# Altium schematic sheet DAC_Filter.SchDoc
size A4; DocumentNumber: 5; SheetNumber: 5; SheetTotal: 9
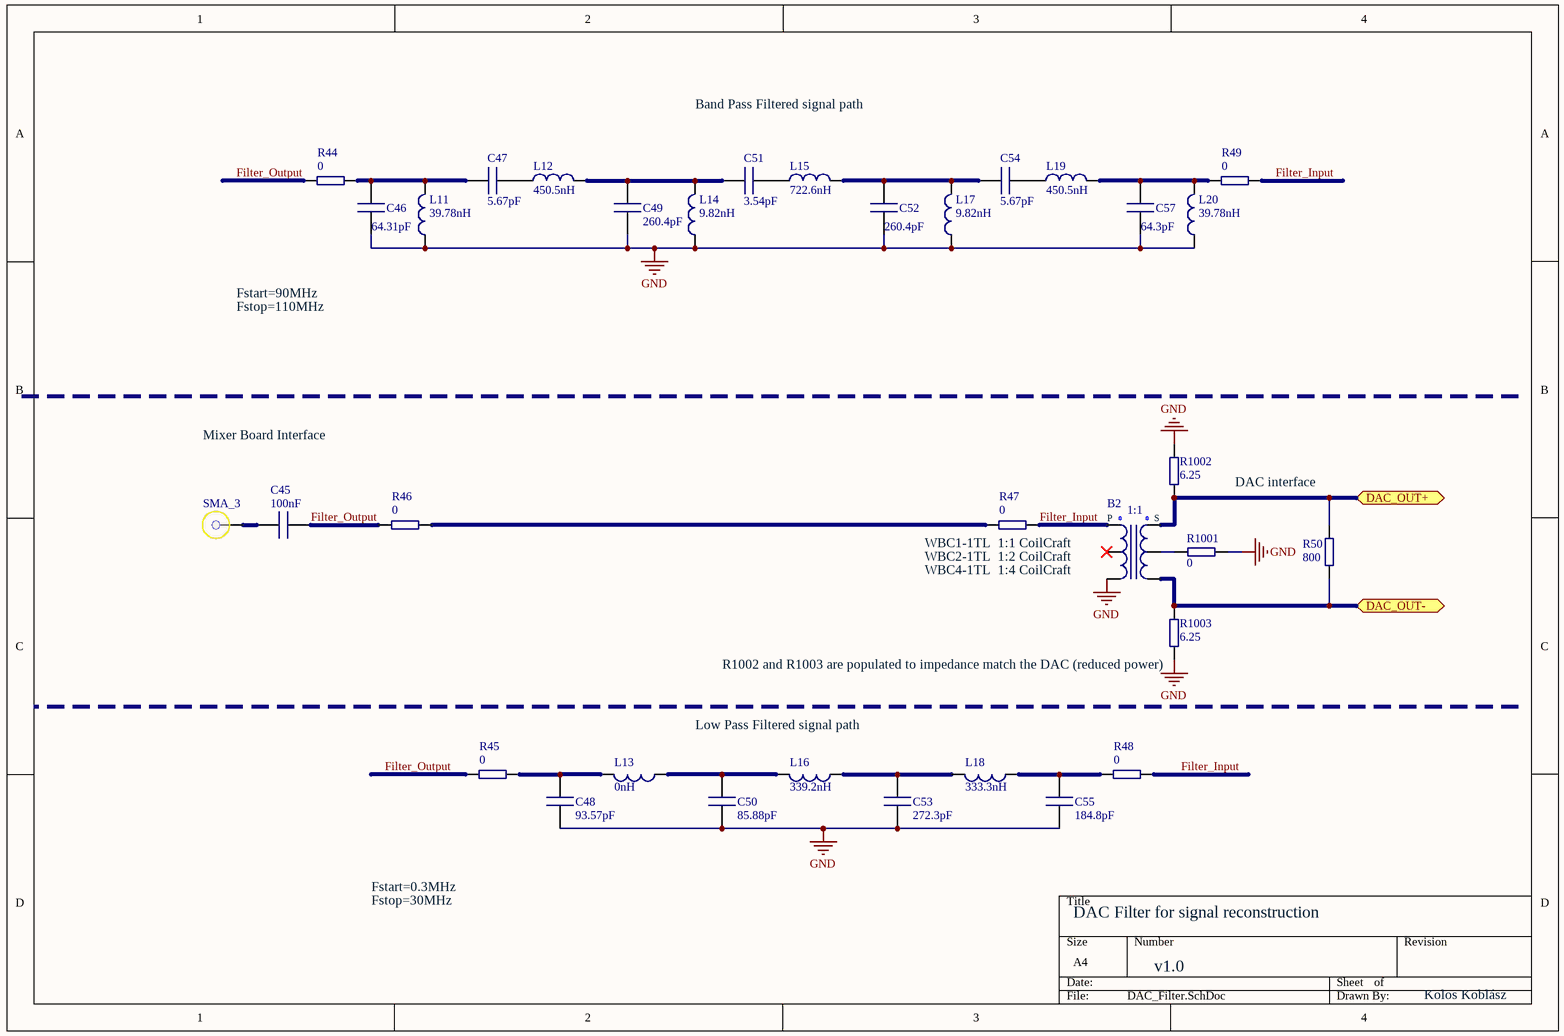
[diagram p0: DAC_Filter.SchDoc]

## Parts
B2  ImpedanceTransformation P : S: 1:1  [Balun_Coil_Craft_WBC]  (hidden comment: Balun)
C45  value 100nF  [0805 SMD Passive]  (hidden comment: Cap1)
C46  value 64.31pF  [0805 SMD Passive]  (hidden comment: Cap1)
C47  value 5.67pF  [0805 SMD Passive]  (hidden comment: Cap1)
C48  value 93.57pF  [0805 SMD Passive]  (hidden comment: Cap1)
C49  value 260.4pF  [0805 SMD Passive]  (hidden comment: Cap1)
C50  value 85.88pF  [0805 SMD Passive]  (hidden comment: Cap1)
C51  value 3.54pF  [0805 SMD Passive]  (hidden comment: Cap1)
C52  value 260.4pF  [0805 SMD Passive]  (hidden comment: Cap1)
C53  value 272.3pF  [0805 SMD Passive]  (hidden comment: Cap1)
C54  value 5.67pF  [0805 SMD Passive]  (hidden comment: Cap1)
C55  value 184.8pF  [0805 SMD Passive]  (hidden comment: Cap1)
C57  value 64.3pF  [0805 SMD Passive]  (hidden comment: Cap1)
L11  value 39.78nH  [0805 SMD Passive]  (hidden comment: Inductor)
L12  value 450.5nH  [0805 SMD Passive]  (hidden comment: Inductor)
L13  value 0nH  [0805 SMD Passive]  (hidden comment: Inductor)
L14  value 9.82nH  [0805 SMD Passive]  (hidden comment: Inductor)
L15  value 722.6nH  [0805 SMD Passive]  (hidden comment: Inductor)
L16  value 339.2nH  [0805 SMD Passive]  (hidden comment: Inductor)
L17  value 9.82nH  [0805 SMD Passive]  (hidden comment: Inductor)
L18  value 333.3nH  [0805 SMD Passive]  (hidden comment: Inductor)
L19  value 450.5nH  [0805 SMD Passive]  (hidden comment: Inductor)
L20  value 39.78nH  [0805 SMD Passive]  (hidden comment: Inductor)
R44  value 0  [0805 SMD Passive]  (hidden comment: Resistor)
R45  value 0  [0805 SMD Passive]  (hidden comment: Resistor)
R46  value 0  [0805 SMD Passive]  (hidden comment: Resistor)
R47  value 0  [0805 SMD Passive]  (hidden comment: Resistor)
R48  value 0  [0805 SMD Passive]  (hidden comment: Resistor)
R49  value 0  [0805 SMD Passive]  (hidden comment: Resistor)
R50  value 800  [0805 SMD Passive]  (hidden comment: Resistor)
R1001  value 0  [0805 SMD Passive]  (hidden comment: Resistor)
R1002  value 6.25  [0805 SMD Passive]  (hidden comment: Resistor)
R1003  value 6.25  [0805 SMD Passive]  (hidden comment: Resistor)
SMA_3  SMA1  [SMA Flange]  (value not drawn)

## Ports
DAC_OUT+, DAC_OUT-

## Nets
GND: B2.4 C46.2 C48.1 C49.2 C50.1 C52.2 C53.1 C55.1 C57.2 L11.1 L14.1 L17.1 L20.1 R1001.2 R1002.2 R1003.2
DAC_OUT+: B2.1 R50.2 R1002.1 ; port DAC_OUT+
DAC_OUT-: B2.3 R50.1 R1003.1 ; port DAC_OUT-
Filter_Input: B2.6 R47.1 R48.1 R49.1
Filter_Output: C45.1 R44.2 R45.2 R46.1
NetB2_2: B2.2 R1001.1
NetC45_2: C45.2 SMA_3.1
NetC46_1: C46.1 C47.1 L11.2 R44.1
NetC47_2: C47.2 L12.1
NetC48_2: C48.2 L13.2 R45.1
NetC49_1: C49.1 C51.1 L12.2 L14.2
NetC50_2: C50.2 L13.1 L16.2
NetC51_2: C51.2 L15.1
NetC52_1: C52.1 C54.1 L15.2 L17.2
NetC53_2: C53.2 L16.1 L18.2
NetC54_2: C54.2 L19.1
NetC55_2: C55.2 L18.1 R48.2
NetC57_1: C57.1 L19.2 L20.2 R49.2
NetR46_2: R46.2 R47.2

Not connected (* = marked no-connect by the designer): B2 5*

## Notes on the sheet
- Band Pass Filtered signal path
- Fstart=90MHz
- Fstop=110MHz
- Mixer Board Interface
- DAC interface
- (near R47) WBC1-1TL  1:1 CoilCraft
- WBC2-1TL  1:2 CoilCraft
- WBC4-1TL  1:4 CoilCraft
- (near R1003) R1002 and R1003 are populated to impedance match the DAC (reduced power)
- Low Pass Filtered signal path
- Fstart=0.3MHz
- Fstop=30MHz
- DAC Filter for signal reconstruction
- v1.0
- Kolos Koblász
- (in symbol Balun3) P; S

## Library data of the parts
B2 = Balun3: SMD Balun; Manufacturer: CoilCraft; PartNumber: WBC1-1TL; MaxFrequency: 700MHz; MinFrequency: 0.25MHz; FootPrint: SMD
C45-C55 C57 = Cap1: SMD Capacitor; Precision: 1%; MaxVolt: 16V; FootPrint: *
L11-L20 = Ind1: SMD Inductor; Precision: 10%; MaxCurent: 100mA; FootPrint: SMD
R44-R50 R1001-R1003 = Res1: SMD Resistor; Precision: 1%; MaxPower: 0.1W; FootPrint: SMD
SMA_3 = SMA1: SMA Female; Shape: Straight; Footprint: *; PartNumber: *; Manufacturer: *; OrderCode: *; Mounting: TroughHole